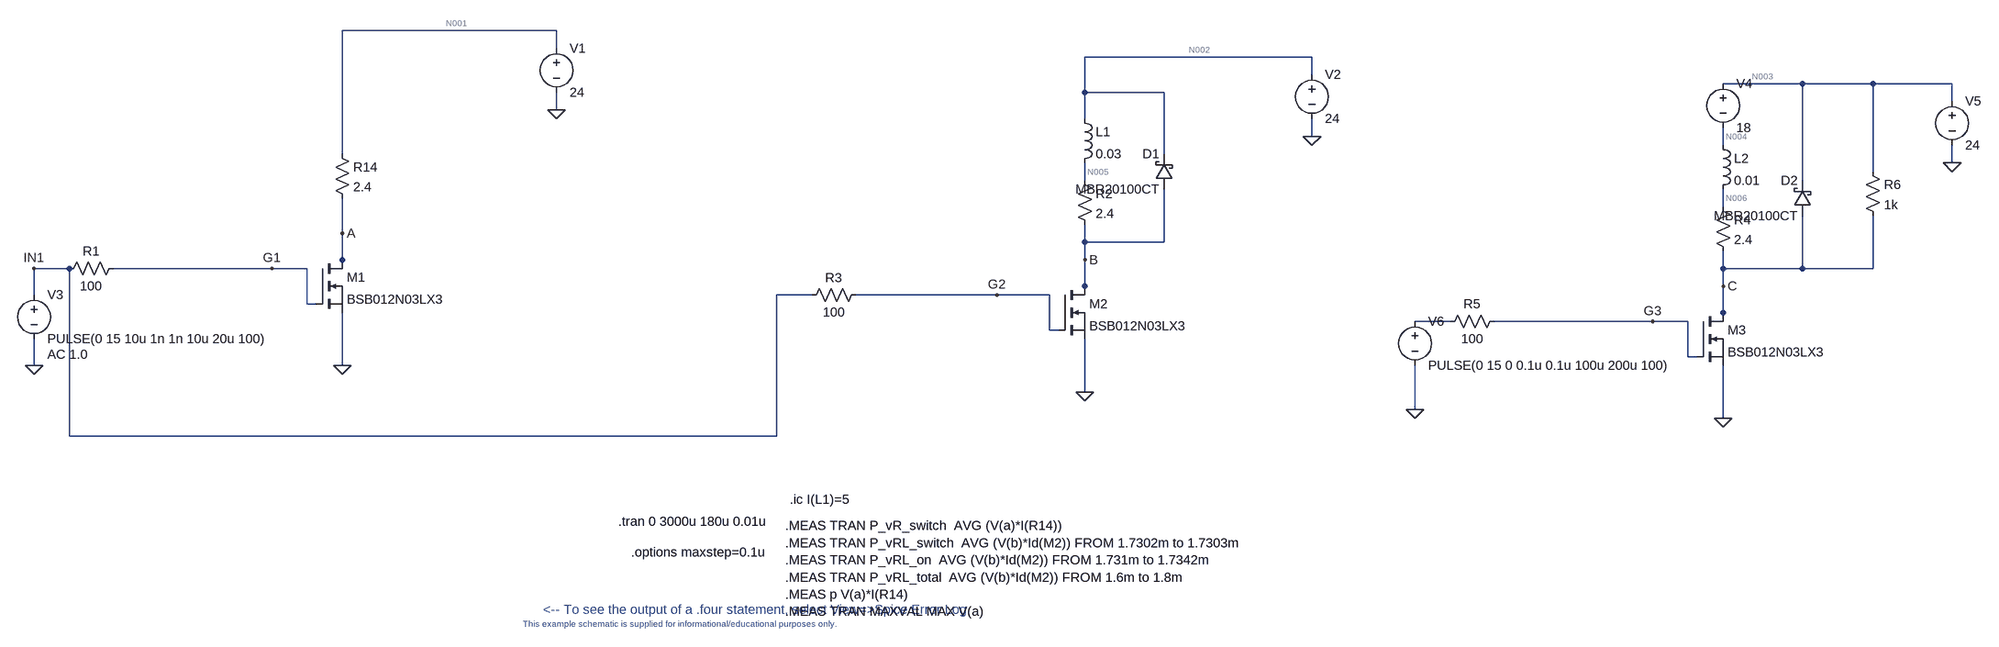
[diagram p0: schematic FetSwitchFH1.asc]
FetSwitchFH1.asc, the LTspice schematic file:
Version 4
SHEET 1 2516 2032
WIRE -688 -32 -1104 -32
WIRE -688 0 -688 -32
WIRE 688 16 272 16
WIRE 688 48 688 16
WIRE 1616 64 1472 64
WIRE 1744 64 1616 64
WIRE 1888 64 1744 64
WIRE 272 80 272 16
WIRE 416 80 272 80
WIRE 1888 96 1888 64
WIRE -688 112 -688 80
WIRE 272 128 272 80
WIRE 688 160 688 128
WIRE 1472 176 1472 144
WIRE -1104 192 -1104 -32
WIRE 416 192 416 80
WIRE 1888 208 1888 176
WIRE 1744 224 1744 64
WIRE 272 240 272 208
WIRE 1616 240 1616 64
WIRE 1472 288 1472 256
WIRE -1104 336 -1104 272
WIRE 272 352 272 320
WIRE 416 352 416 256
WIRE 416 352 272 352
WIRE -1104 384 -1104 336
WIRE 272 384 272 352
WIRE -1600 400 -1664 400
WIRE -1232 400 -1520 400
WIRE -1168 400 -1232 400
WIRE -1104 400 -1104 384
WIRE 1472 400 1472 368
WIRE 1616 400 1616 304
WIRE 1616 400 1472 400
WIRE 1744 400 1744 304
WIRE 1744 400 1616 400
WIRE 272 432 272 384
WIRE 1472 432 1472 400
WIRE -1664 448 -1664 400
WIRE -224 448 -288 448
WIRE 112 448 -144 448
WIRE 208 448 112 448
WIRE 272 448 272 432
WIRE -1168 464 -1168 400
WIRE -1152 464 -1168 464
WIRE 1472 480 1472 432
WIRE 976 496 912 496
WIRE 1344 496 1056 496
WIRE 1408 496 1344 496
WIRE 1472 496 1472 480
WIRE 208 512 208 448
WIRE 224 512 208 512
WIRE 1408 560 1408 496
WIRE 1424 560 1408 560
WIRE -1664 576 -1664 528
WIRE -1104 576 -1104 480
WIRE 272 624 272 528
WIRE 912 656 912 576
WIRE 1472 672 1472 576
WIRE -1600 704 -1600 400
WIRE -288 704 -288 448
WIRE -288 704 -1600 704
FLAG -688 112 0
FLAG -1104 576 0
FLAG -1664 576 0
FLAG -1664 400 IN1
FLAG -1104 336 A
FLAG 688 160 0
FLAG 272 624 0
FLAG 272 384 B
FLAG 1888 208 0
FLAG 1472 672 0
FLAG 1472 432 C
FLAG -1232 400 G1
FLAG 112 448 G2
FLAG 1344 496 G3
FLAG 912 656 0
SYMBOL VOLTAGE -688 -16 R0
WINDOW 123 0 0 Left 2
WINDOW 39 0 0 Left 2
SYMATTR InstName V1
SYMATTR Value 24
SYMBOL res -1120 176 R0
SYMATTR InstName R14
SYMATTR Value 2.4
SYMBOL voltage -1664 432 R0
WINDOW 123 24 124 Left 2
WINDOW 39 0 0 Left 2
SYMATTR Value2 AC 1.0
SYMATTR InstName V3
SYMATTR Value PULSE(0 15 10u 1n 1n 10u 20u 100)
SYMBOL res -1504 384 R90
WINDOW 0 0 56 VBottom 2
WINDOW 3 32 56 VTop 2
SYMATTR InstName R1
SYMATTR Value 100
SYMBOL nmos -1152 384 R0
SYMATTR InstName M1
SYMATTR Value BSB012N03LX3
SYMBOL VOLTAGE 688 32 R0
WINDOW 123 0 0 Left 2
WINDOW 39 0 0 Left 2
SYMATTR InstName V2
SYMATTR Value 24
SYMBOL res 256 224 R0
SYMATTR InstName R2
SYMATTR Value 2.4
SYMBOL res -128 432 R90
WINDOW 0 0 56 VBottom 2
WINDOW 3 32 56 VTop 2
SYMATTR InstName R3
SYMATTR Value 100
SYMBOL nmos 224 432 R0
SYMATTR InstName M2
SYMATTR Value BSB012N03LX3
SYMBOL ind 256 112 R0
SYMATTR InstName L1
SYMATTR Value 0.03
SYMBOL schottky 432 256 R180
WINDOW 0 24 64 Left 2
WINDOW 3 24 0 Left 2
SYMATTR InstName D1
SYMATTR Value MBR20100CT
SYMATTR Description Diode
SYMATTR Type diode
SYMBOL VOLTAGE 1888 80 R0
WINDOW 123 0 0 Left 2
WINDOW 39 0 0 Left 2
SYMATTR InstName V5
SYMATTR Value 24
SYMBOL res 1456 272 R0
SYMATTR InstName R4
SYMATTR Value 2.4
SYMBOL res 1072 480 R90
WINDOW 0 0 56 VBottom 2
WINDOW 3 32 56 VTop 2
SYMATTR InstName R5
SYMATTR Value 100
SYMBOL nmos 1424 480 R0
SYMATTR InstName M3
SYMATTR Value BSB012N03LX3
SYMBOL ind 1456 160 R0
SYMATTR InstName L2
SYMATTR Value 0.01
SYMATTR SpiceLine Ipk=9
SYMBOL schottky 1632 304 R180
WINDOW 0 24 64 Left 2
WINDOW 3 24 0 Left 2
SYMATTR InstName D2
SYMATTR Value MBR20100CT
SYMATTR Description Diode
SYMATTR Type diode
SYMBOL VOLTAGE 1472 48 R0
WINDOW 123 0 0 Left 2
WINDOW 39 0 0 Left 2
SYMATTR InstName V4
SYMATTR Value 18
SYMBOL voltage 912 480 R0
WINDOW 123 0 0 Left 2
WINDOW 39 0 0 Left 2
SYMATTR InstName V6
SYMATTR Value PULSE(0 15 0 0.1u 0.1u 100u 200u 100)
SYMBOL res 1728 208 R0
SYMATTR InstName R6
SYMATTR Value 1k
TEXT -576 944 Left 2 !.tran 0 3000u 180u 0.01u
TEXT -552 1000 Left 2 !.options maxstep=0.1u
TEXT -464 1120 Top 1 ;This example schematic is supplied for informational/educational purposes only.
TEXT -712 1104 Left 2 ;<-- To see the output of a .four statement, select View=>Spice Error Log
TEXT -272 952 Left 2 !.MEAS TRAN P_vR_switch  AVG (V(a)*I(R14)) \n.MEAS TRAN P_vRL_switch  AVG (V(b)*Id(M2)) FROM 1.7302m to 1.7303m\n.MEAS TRAN P_vRL_on  AVG (V(b)*Id(M2)) FROM 1.731m to 1.7342m\n.MEAS TRAN P_vRL_total  AVG (V(b)*Id(M2)) FROM 1.6m to 1.8m\n.MEAS p V(a)*I(R14)\n.MEAS TRAN MAXVAL MAX V(a)
TEXT -264 904 Left 2 !.ic I(L1)=5

The netlist it stands for:
* FetSwitchFH1.asc
V1 N001 0 24
R14 N001 A 2.4
V3 IN1 0 PULSE(0 15 10u 1n 1n 10u 20u 100) AC 1.0
R1 G1 IN1 100
M1 A G1 0 0 BSB012N03LX3
V2 N002 0 24
R2 N005 B 2.4
R3 G2 IN1 100
M2 B G2 0 0 BSB012N03LX3
L1 N002 N005 0.03
D1 B N002 MBR20100CT
V5 N003 0 24
R4 N006 C 2.4
R5 G3 N007 100
M3 C G3 0 0 BSB012N03LX3
L2 N004 N006 0.01 Ipk=9
D2 C N003 MBR20100CT
V4 N003 N004 18
V6 N007 0 PULSE(0 15 0 0.1u 0.1u 100u 200u 100)
R6 N003 C 1k
.model D D
.lib standard.dio
.model NMOS NMOS
.model PMOS PMOS
.lib standard.mos
.tran 0 3000u 180u 0.01u
.options maxstep=0.1u
* This example schematic is supplied for informational/educational purposes only.
* <-- To see the output of a .four statement, select View=>Spice Error Log
.MEAS TRAN P_vR_switch  AVG (V(a)*I(R14))
.MEAS TRAN P_vRL_switch  AVG (V(b)*Id(M2)) FROM 1.7302m to 1.7303m
.MEAS TRAN P_vRL_on  AVG (V(b)*Id(M2)) FROM 1.731m to 1.7342m
.MEAS TRAN P_vRL_total  AVG (V(b)*Id(M2)) FROM 1.6m to 1.8m
.MEAS p V(a)*I(R14)
.MEAS TRAN MAXVAL MAX V(a)
.ic I(L1)=5
.backanno
.end

* Results of the author's LTspice run, read from the files saved beside the schematic
* Operating Point, zero values left out:
*   V(n001) = 24 V
*   V(a) = 24 V
*   V(n002) = 24 V
*   V(n005) = 36.64 V
*   V(b) = 24.64 V
*   V(n003) = 24 V
*   V(n006) = 6 V
*   V(c) = 6.043 V
*   V(n004) = 6 V
*   Id(M1) = 102 pA
*   Is(M1) = -102 pA
*   Id(M2) = 102 pA
*   Is(M2) = -102 pA
*   Id(M3) = 88.12 pA
*   Is(M3) = -88.12 pA
*   I(D1) = 5 A
*   I(D2) = -61.63 µA
*   I(L1) = 5 A
*   I(L2) = -18.02 mA
*   I(R14) = 116.4 pA
*   I(R2) = 5 A
*   I(R4) = -18.02 mA
*   I(R6) = 17.96 mA
*   I(V1) = -116.4 pA
*   I(V2) = -118 pA
*   I(V5) = -92.27 pA
*   I(V4) = -18.02 mA
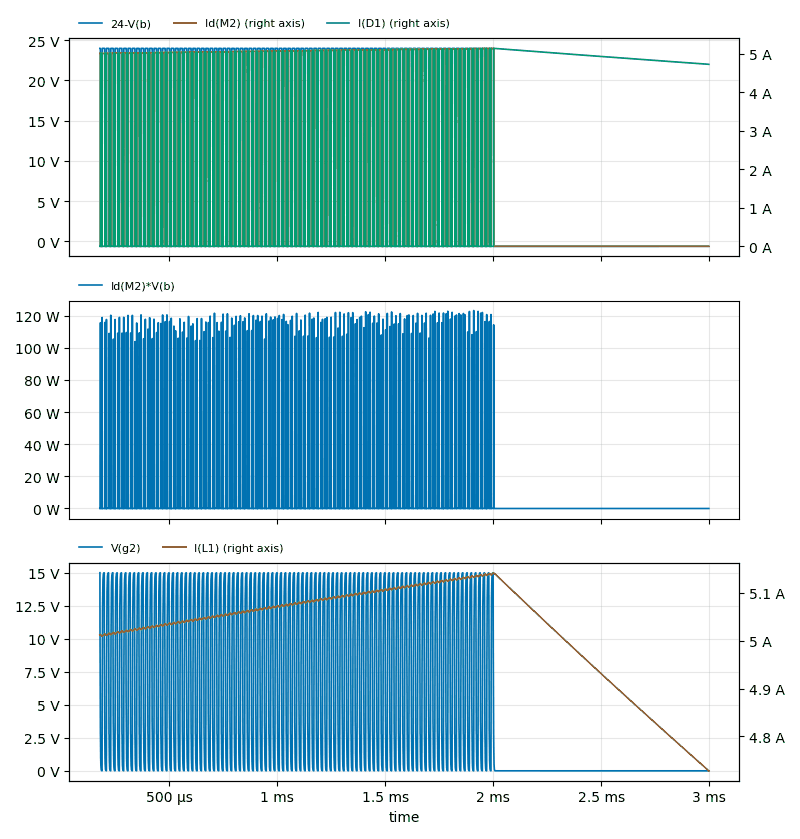
[diagram p1: Transient Analysis of FetSwitchFH1.asc, plotted from the saved traces]
* Transient Analysis, 1 run:
*   24-V(b): min -646.1 mV, max 24 V, average 9.037 V, rms 14.99 V, last -637.5 mV
*   Id(M2): min -3.217 mA, max 5.143 A, average 2.031 A, rms 3.209 A, last 0 A
*   I(D1): min -3.49 mA, max 5.142 A, average 2.995 A, rms 3.866 A, last 4.727 A
*   Id(M2)*V(b): min -79.28 mW, max 123.2 W, average 895.2 mW, rms 7.769 W, last 0 W
*   V(g2): min 0 V, max 15 V, average 4.848 V, rms 7.977 V, last 0 V
*   I(L1): min 4.727 A, max 5.142 A, average 5.026 A, rms 5.027 A, last 4.727 A